# EasyEDA schematic SCH_Firefly_v0.1_2025-03-03.json
TITLE: Firefly; REV: 0.1; Date: 2025-01-26; Sheet: 1/1; Drawn By: Navaneeth Bhardwaj; Company: Kiskoot Creations
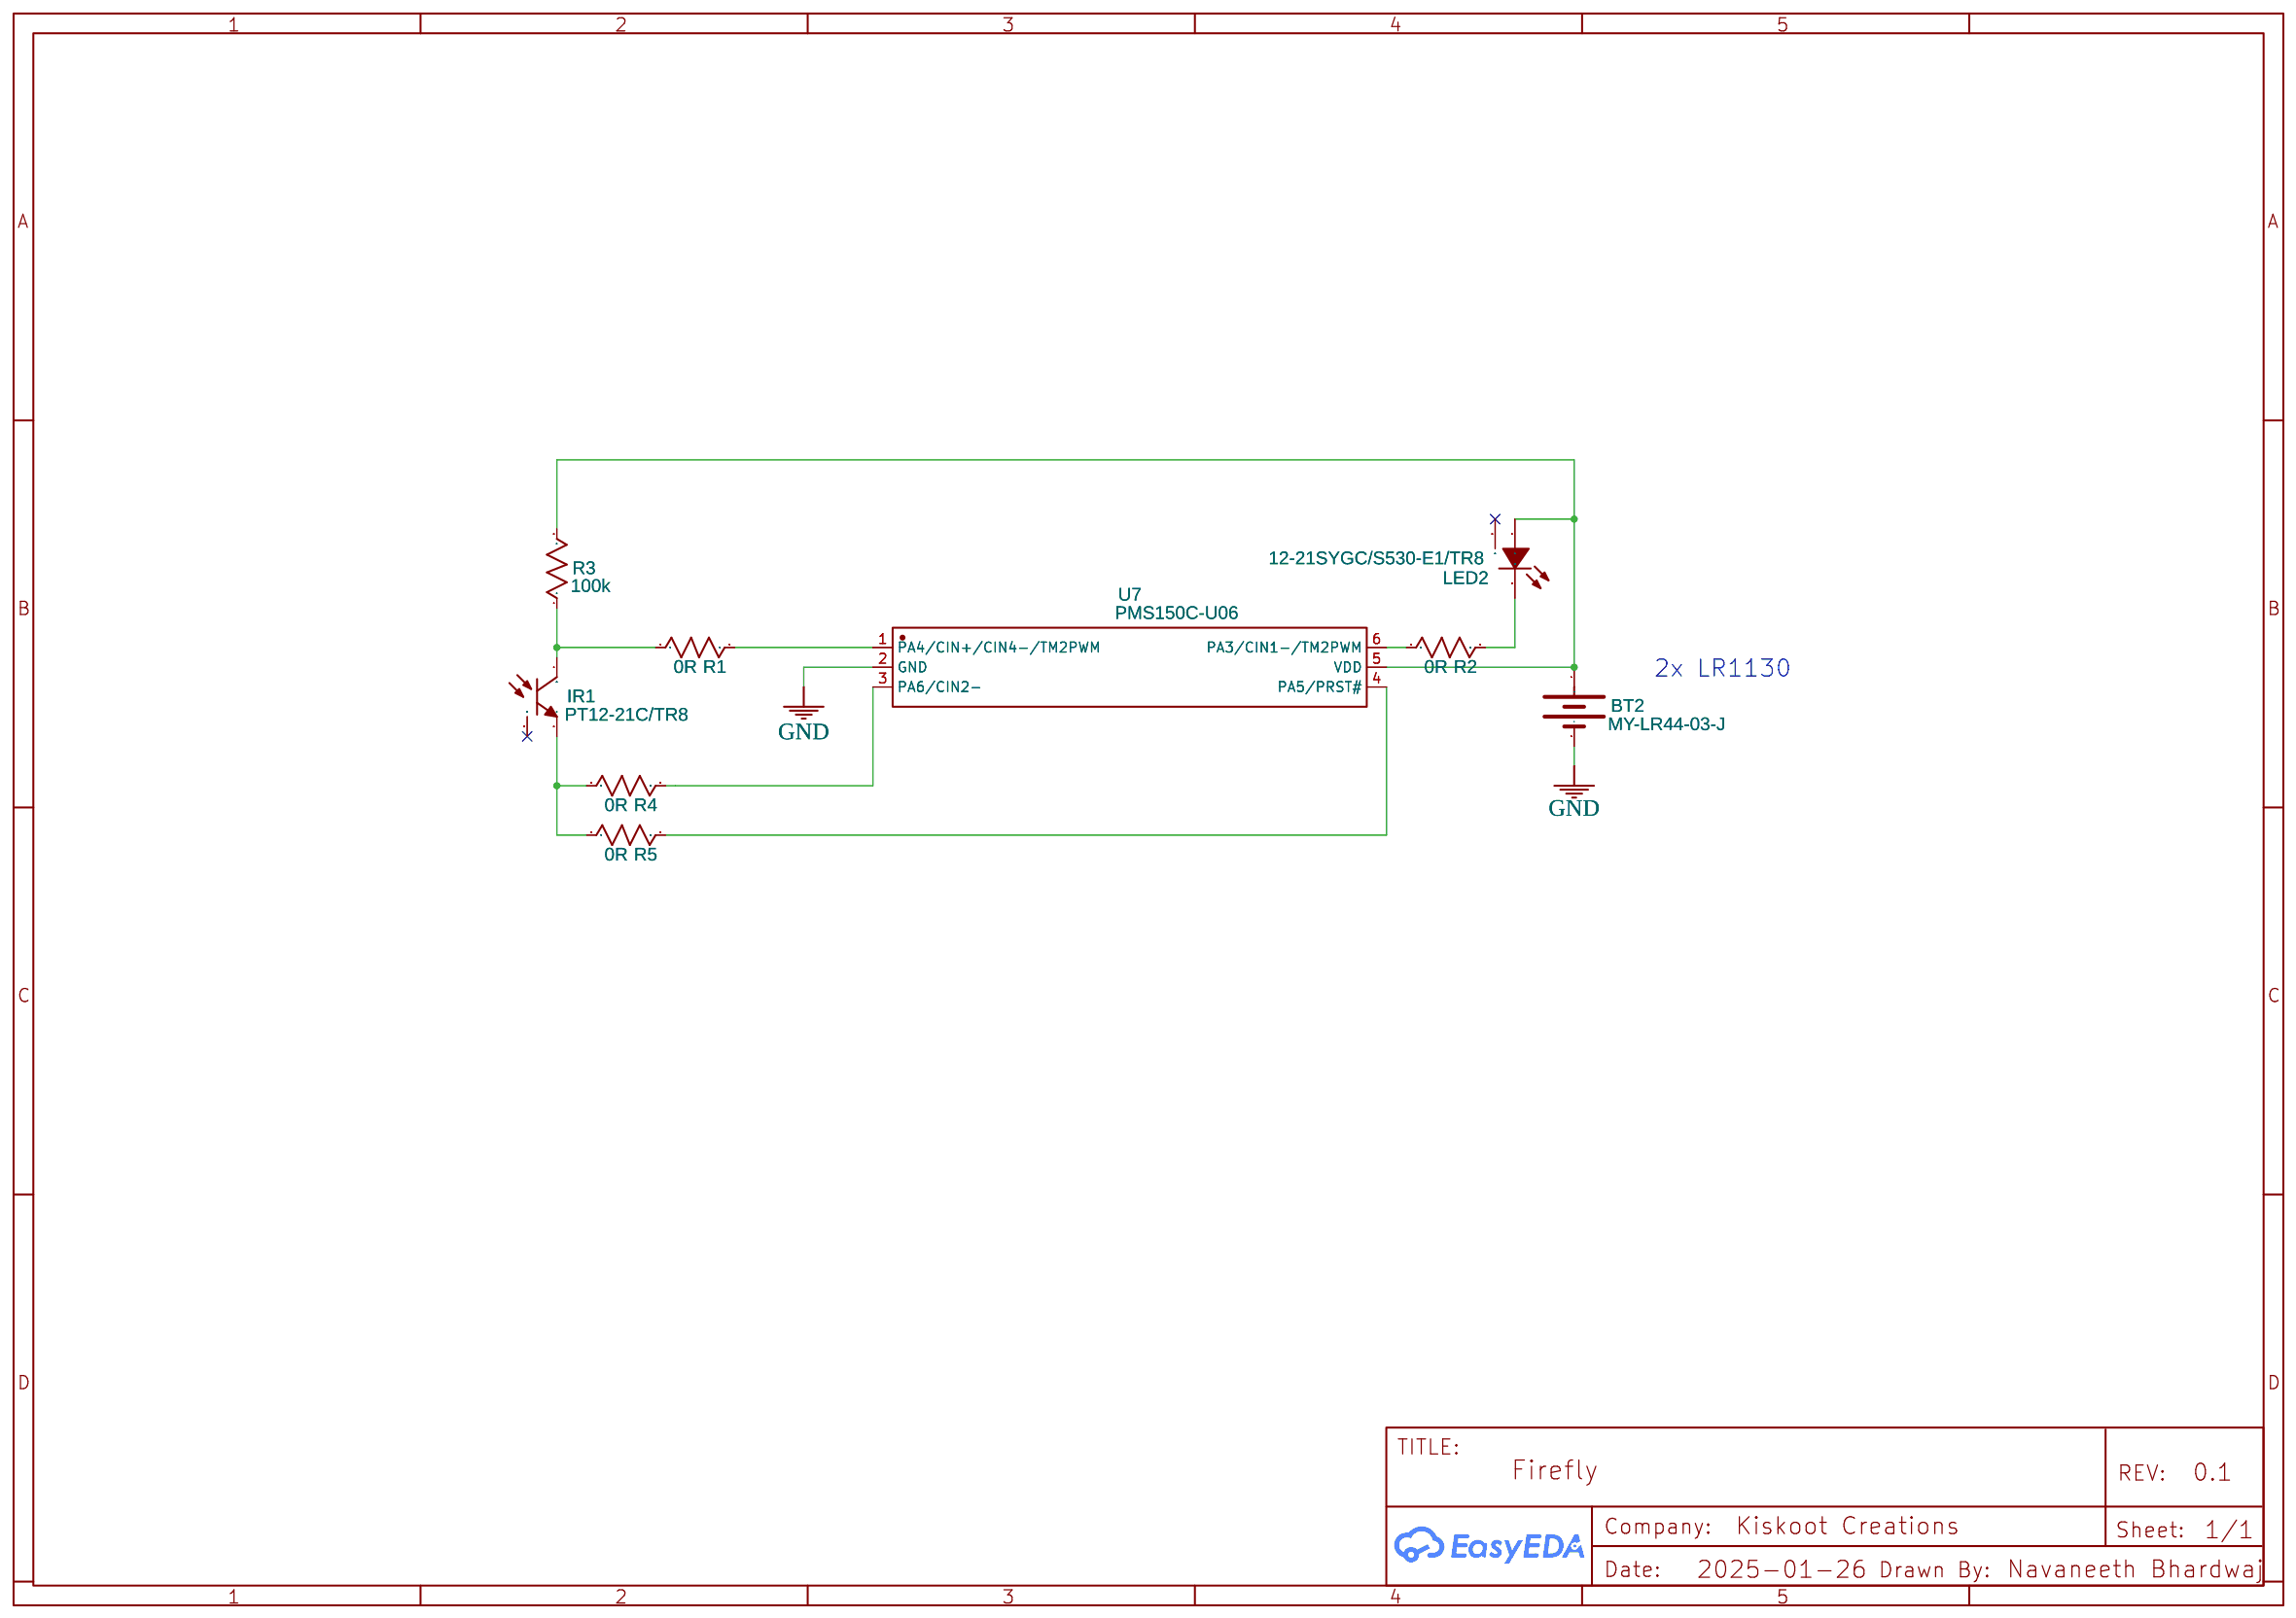
[diagram p0: schematic sheet]

## Parts
BT2  MY-LR44-03-J  [CONN-TH_MY-LR44-03-J]
IR1  PT12-21C/TR8  [SENSOR-SMD_L3.0-W2.0-RD]
LED2  12-21SYGC/S530-E1/TR8  [LED-SMD_12-21C-G6C-KN2P2-2C_GREEN]
R1  0R  [R0402]
R2  0R  [R0402]
R3  100k  [R0402]
R4  0R  [R0402]
R5  0R  [R0402]
U7  PMS150C-U06  [SOT-23-6_L2.9-W1.6-P0.95-LS2.8-BR]

## Library data of the parts
BT2 = MY-LR44-03-J: Supplier: LCSC; Supplier Part: C5457116; Manufacturer: MYOUNG(美阳); JLCPCB Part Class: Extended Part; Contributor: lcsc
IR1 = PT12-21C/TR8: Supplier: LCSC; Manufacturer: EVERLIGHT(亿光); Supplier Part: C53674; JLCPCB Part Class: Extended Part
LED2 = 12-21SYGC/S530-E1/TR8: Contributor: LCSC; Supplier: LCSC; Supplier Part: C131272; Manufacturer: EVERLIGHT(亿光); JLCPCB Part Class: Extended Part
R1-R5 = R_0603_US: Contributor: LCEDA_Lib
U7 = PMS150C-U06: Contributor: LCSC; Supplier: LCSC; Supplier Part: C168658; Manufacturer: PADAUK(应广); JLCPCB Part Class: Extended Part

## Nets
GND: BT2.2(-) U7.2(GND)
Net-(BT2-1): BT2.1(+) LED2.1(A) R3.2 U7.5(VDD)
Net-(IR1-1): IR1.1(C) R1.1 R3.1
Net-(IR1-2): IR1.2(E) R4.1 R5.1
Net-(LED2-2): LED2.2(C) R2.2
Net-(R1-2): R1.2 U7.1(PA4/CIN+/CIN4-/TM2PWM)
Net-(R2-1): R2.1 U7.6(PA3/CIN1-/TM2PWM)
Net-(R4-2): R4.2 U7.3(PA6/CIN2-)
Net-(R5-2): R5.2 U7.4(PA5/PRST#)

Not connected (* = marked no-connect by the designer): IR1 3*; LED2 3*

## Notes on the sheet
- 2x LR1130
